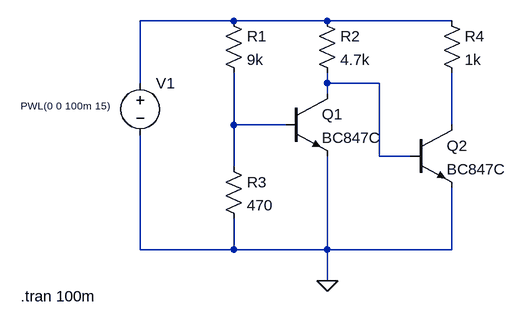
[diagram p0: schematic NPN.asc]
NPN.asc, the LTspice schematic file:
Version 4.1
SHEET 1 880 680
WIRE 128 32 -16 32
WIRE 272 32 128 32
WIRE 464 32 272 32
WIRE -16 128 -16 32
WIRE 272 128 272 112
WIRE 352 128 272 128
WIRE 272 144 272 128
WIRE 128 192 128 112
WIRE 208 192 128 192
WIRE 464 192 464 112
WIRE 352 240 352 128
WIRE 400 240 352 240
WIRE 128 256 128 192
WIRE -16 384 -16 208
WIRE 128 384 128 336
WIRE 128 384 -16 384
WIRE 272 384 272 240
WIRE 272 384 128 384
WIRE 464 384 464 288
WIRE 464 384 272 384
WIRE 272 432 272 384
FLAG 272 432 0
SYMBOL voltage -16 112 R0
WINDOW 3 -184 51 Left 1
WINDOW 123 0 0 Left 0
WINDOW 39 0 0 Left 0
SYMATTR Value PWL(0 0 100m 15)
SYMATTR InstName V1
SYMBOL res 112 16 R0
SYMATTR InstName R1
SYMATTR Value 9k
SYMBOL res 256 16 R0
SYMATTR InstName R2
SYMATTR Value 4.7k
SYMBOL res 112 240 R0
SYMATTR InstName R3
SYMATTR Value 470
SYMBOL res 448 16 R0
SYMATTR InstName R4
SYMATTR Value 1k
SYMBOL npn 208 144 R0
SYMATTR InstName Q1
SYMATTR Value BC847C
SYMBOL npn 400 192 R0
SYMATTR InstName Q2
SYMATTR Value BC847C
TEXT -200 456 Left 2 !.tran 100m

The netlist it stands for:
* NPN.asc
V1 N001 0 PWL(0 0 100m 15)
R1 N001 N003 9k
R2 N001 N002 4.7k
R3 N003 0 470
R4 N001 N004 1k
Q1 N002 N003 0 0 BC847C
Q2 N004 N002 0 0 BC847C
.model NPN NPN
.model PNP PNP
.lib standard.bjt
.tran 100m
.backanno
.end